# Altium schematic sheet Sheet1.SchDoc
size A; SheetNumber: 1; SheetTotal: 5
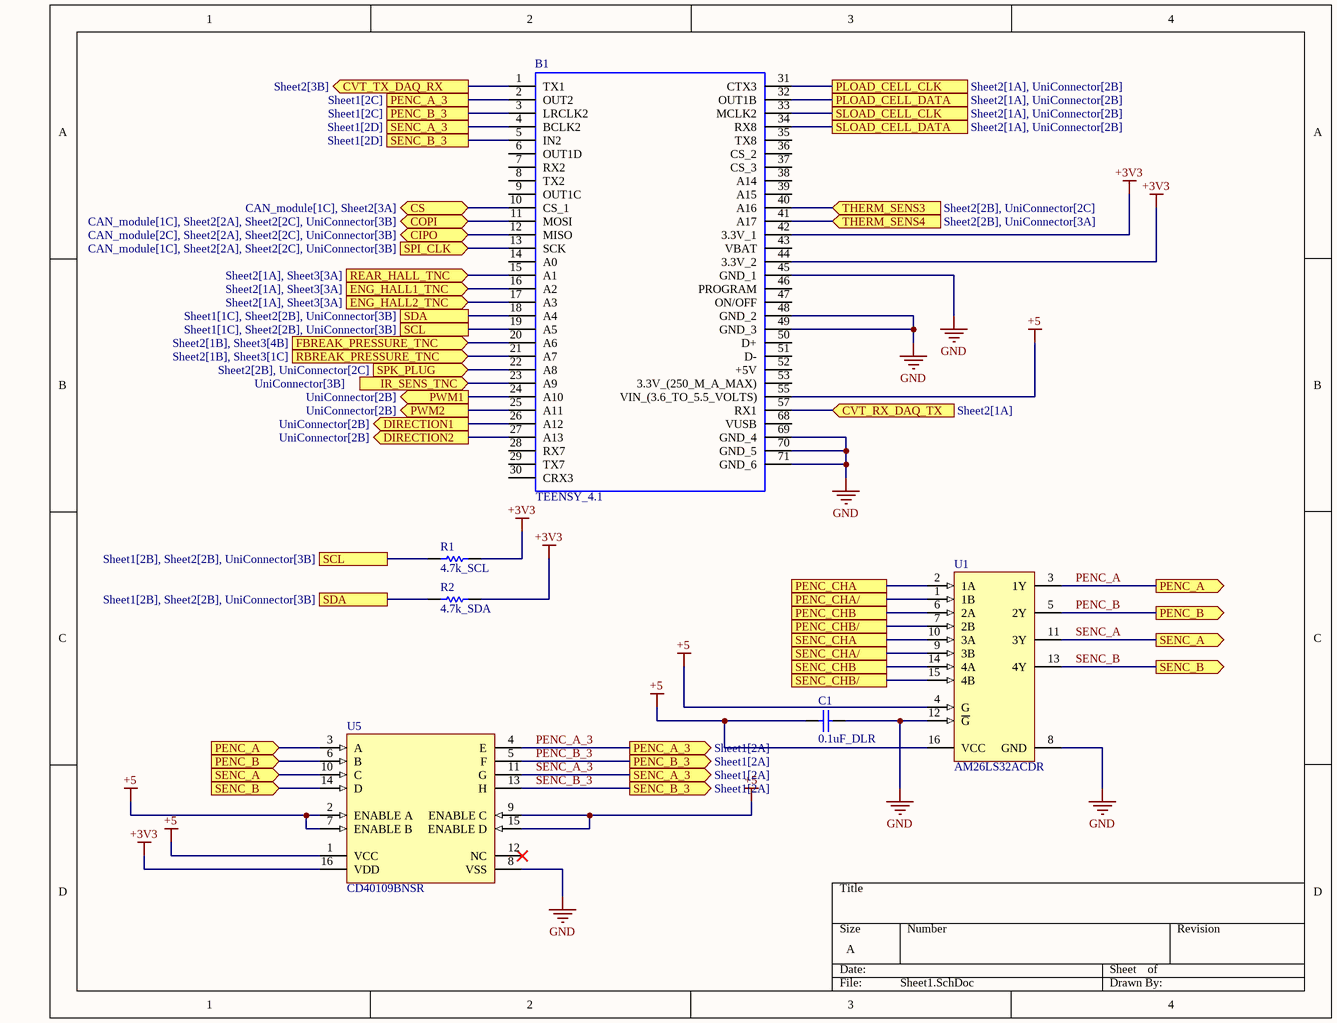
[diagram p0: Sheet1.SchDoc]

## Parts
B1  TEENSY_4.1  [TEENSY41]
C1  0.1uF_DLR  [CAPC2013X94X50LL20T25]
R1  4.7k_SCL  [RESC2013X60X40LL20T25]
R2  4.7k_SDA  [RESC2013X60X40LL20T25]
U1  AM26LS32ACDR  [D0016A_M]
U5  CD40109BNSR  [NS0016A_N]

## Ports
CIPO (bidir, see CAN_module[2C], Sheet2[2A], Sheet2[2C], UniConnector[3B]), COPI (bidir, see CAN_module[1C], Sheet2[2A], Sheet2[2C], UniConnector[3B]), CS (bidir, see CAN_module[1C], Sheet2[3A]), CVT_RX_DAQ_TX (in, see Sheet2[1A]), CVT_TX_DAQ_RX (out, see Sheet2[3B]), DIRECTION1 (out, see UniConnector[2B]), DIRECTION2 (out, see UniConnector[2B]), ENG_HALL1_TNC (in, see Sheet2[1A], Sheet3[3A]), ENG_HALL2_TNC (in, see Sheet2[1A], Sheet3[3A]), FBREAK_PRESSURE_TNC (in, see Sheet2[1B], Sheet3[4B]), IR_SENS_TNC (in, see UniConnector[3B]), PENC_A (in, see Sheet1[4C]), PENC_A (out, see Sheet1[1C]), PENC_A_3 (out, see Sheet1[2A]), PENC_A_3 (see Sheet1[2C]), PENC_B (in, see Sheet1[4C]), PENC_B (out, see Sheet1[1C]), PENC_B_3 (out, see Sheet1[2A]), PENC_B_3 (see Sheet1[2C]), PENC_CHA (see UniConnector[2A]), PENC_CHA/ (see UniConnector[2A]), PENC_CHB (see UniConnector[2A]), PENC_CHB/ (see UniConnector[2B]), PLOAD_CELL_CLK (see Sheet2[1A], UniConnector[2B]), PLOAD_CELL_DATA (see Sheet2[1A], UniConnector[2B]), PWM1 (out, see UniConnector[2B]), PWM2 (out, see UniConnector[2B]), RBREAK_PRESSURE_TNC (in, see Sheet2[1B], Sheet3[1C]), REAR_HALL_TNC (in, see Sheet2[1A], Sheet3[3A]), SCL (see Sheet1[1C], Sheet2[2B], UniConnector[3B]), SCL (see Sheet1[2B], Sheet2[2B], UniConnector[3B]), SDA (see Sheet1[1C], Sheet2[2B], UniConnector[3B]), SDA (see Sheet1[2B], Sheet2[2B], UniConnector[3B]), SENC_A (in, see Sheet1[4C]), SENC_A (out, see Sheet1[1D]), SENC_A_3 (out, see Sheet1[2A]), SENC_A_3 (see Sheet1[2D]), SENC_B (in, see Sheet1[4C]), SENC_B (out, see Sheet1[1D]), SENC_B_3 (out, see Sheet1[2A]), SENC_B_3 (see Sheet1[2D]), SENC_CHA (see UniConnector[2B]), SENC_CHA/ (see UniConnector[2B]), SENC_CHB (see UniConnector[2B]), SENC_CHB/ (see UniConnector[2B]), SLOAD_CELL_CLK (see Sheet2[1A], UniConnector[2B]), SLOAD_CELL_DATA (see Sheet2[1A], UniConnector[2B]), SPI_CLK (in, see CAN_module[1C], Sheet2[2A], Sheet2[2C], UniConnector[3B]), SPK_PLUG (in, see Sheet2[2B], UniConnector[2C]), THERM_SENS3 (in, see Sheet2[2B], UniConnector[2C]), THERM_SENS4 (in, see Sheet2[2B], UniConnector[3A])

## Nets
+3V3: B1.42(3.3V_1) B1.44(3.3V_2) R1.2 R2.2 U5.16(VDD)
+5: B1.55(VIN_(3.6_TO_5.5_VOLTS)) C1.1 U1.4(G) U1.16(VCC) U5.1(VCC) U5.2(ENABLE_A) U5.7(ENABLE_B) U5.9(ENABLE_C) U5.15(ENABLE_D)
GND: B1.45(GND_1) B1.48(GND_2) B1.49(GND_3) B1.69(GND_4) B1.70(GND_5) B1.71(GND_6) C1.2 U1.8(GND) U1.12(~{G}) U5.8(VSS)
CIPO: B1.12(MISO) ; port CIPO
COPI: B1.11(MOSI) ; port COPI
CS: B1.10(CS_1) ; port CS
CVT_RX_DAQ_TX: B1.57(RX1) ; port CVT_RX_DAQ_TX
CVT_TX_DAQ_RX: B1.1(TX1) ; port CVT_TX_DAQ_RX
DIRECTION1: B1.26(A12) ; port DIRECTION1
DIRECTION2: B1.27(A13) ; port DIRECTION2
ENG_HALL1_TNC: B1.16(A2) ; port ENG_HALL1_TNC
ENG_HALL2_TNC: B1.17(A3) ; port ENG_HALL2_TNC
FBREAK_PRESSURE_TNC: B1.20(A6) ; port FBREAK_PRESSURE_TNC
IR_SENS_TNC: B1.23(A9) ; port IR_SENS_TNC
PENC_A: U1.3(1Y) U5.3(A) ; port PENC_A
PENC_A_3: B1.2(OUT2) U5.4(E) ; port PENC_A_3
PENC_B: U1.5(2Y) U5.6(B) ; port PENC_B
PENC_B_3: B1.3(LRCLK2) U5.5(F) ; port PENC_B_3
PENC_CHA: U1.2(1A) ; port PENC_CHA
PENC_CHA/: U1.1(1B) ; port PENC_CHA/
PENC_CHB: U1.6(2A) ; port PENC_CHB
PENC_CHB/: U1.7(2B) ; port PENC_CHB/
PLOAD_CELL_CLK: B1.31(CTX3) ; port PLOAD_CELL_CLK
PLOAD_CELL_DATA: B1.32(OUT1B) ; port PLOAD_CELL_DATA
PWM1: B1.24(A10) ; port PWM1
PWM2: B1.25(A11) ; port PWM2
RBREAK_PRESSURE_TNC: B1.21(A7) ; port RBREAK_PRESSURE_TNC
REAR_HALL_TNC: B1.15(A1) ; port REAR_HALL_TNC
SCL: B1.19(A5) R1.1 ; port SCL
SDA: B1.18(A4) R2.1 ; port SDA
SENC_A: U1.11(3Y) U5.10(C) ; port SENC_A
SENC_A_3: B1.4(BCLK2) U5.11(G) ; port SENC_A_3
SENC_B: U1.13(4Y) U5.14(D) ; port SENC_B
SENC_B_3: B1.5(IN2) U5.13(H) ; port SENC_B_3
SENC_CHA: U1.10(3A) ; port SENC_CHA
SENC_CHA/: U1.9(3B) ; port SENC_CHA/
SENC_CHB: U1.14(4A) ; port SENC_CHB
SENC_CHB/: U1.15(4B) ; port SENC_CHB/
SLOAD_CELL_CLK: B1.33(MCLK2) ; port SLOAD_CELL_CLK
SLOAD_CELL_DATA: B1.34(RX8) ; port SLOAD_CELL_DATA
SPI_CLK: B1.13(SCK) ; port SPI_CLK
SPK_PLUG: B1.22(A8) ; port SPK_PLUG
THERM_SENS3: B1.40(A16) ; port THERM_SENS3
THERM_SENS4: B1.41(A17) ; port THERM_SENS4

Not connected (* = marked no-connect by the designer): B1 6(OUT1D) 7(RX2) 8(TX2) 9(OUT1C) 14(A0) 28(RX7) 29(TX7) 30(CRX3) 35(TX8) 36(CS_2) 37(CS_3) 38(A14) 39(A15) 43(VBAT) 46(PROGRAM) 47(ON/OFF) 50(D+) 51(D-) 52(+5V) 53(3.3V_(250_M_A_MAX)) 68(VUSB); U5 12(NC)*

## Library data of the parts
B1 = TEENSY_4.1: Teensy 4.1 Development Board; Manufacturer_Name: PJRC; Manufacturer_Part_Number: TEENSY 4.1; Mouser Part Number: *; Mouser Price/Stock: *; Arrow Part Number: *; Arrow Price/Stock: *; Mouser Testing Part Number: *; Mouser Testing Price/Stock: *; Datasheet Link: https://www.pjrc.com/store/teensy41.html
C1 = CMP-2007-04345-1: Manufacturer: AVX Interconnect / Elco; Part Number: 08055A6R2CAT2A
R1 R2 = CMP-2001-00877-1: Manufacturer: Panasonic; Part Number: ERA6AEB7870V
U1 = CMP-0310-00258-2: Quadruple Differential Line Receiver, 0 TX / 4 RX, 0 to 70 degC, 16-Pin SOIC (D), Green (RoHS & no Sb/Br); Manufacturer: Texas Instruments; Rating: Catalog; ICC(Max)(mA): 70; SubFamily: RS-422; Receivers Per Package: 4; ComponentLink1Description: Datasheet; # of TX/RX: 0 TX / 4 RX; Mounting Technology: Surface Mount; Code_JEDEC: MS-012AC; DatasheetVersion: SLLS115E; ComponentLink2Description: Package Specification; Eco-Plan: Green (RoHS & no Sb/Br); PackageDescription: 16-Pin Plastic Small Outline Integrated Circuit, 9.9 x 3.9 mm, Pitch 1.27 mm Pitch; ComponentLink2URL: http://www.ti.com/litv/pdf/mpds178g; PartNumber: AM26LS32ACDR; PackageReference: D0016A; PackageVersion: revM, Jun-2011; ComponentLink1URL: http://www.ti.com/general/docs/lit/getliterature.tsp?genericPartNumber=AM26LS32AC&fileType=pdf
U5 = CMP-1527-00005-2: CMOS Quad Low-to-High Voltage Level Shifter, 3 to 18 V, -55 to 125 degC, 16-Pin SO (NS16), RoHS, Tape and Reel; Manufacturer: Texas Instruments; Number of Channels: 4; VSS: 3 to 18 V; Propagation Delay: 240 ns Max.; ComponentLink2Description: Datasheet; PackageDescription: 16-Pin Plastic Small Outline Package, Body 10.2 x 5.3 mm, Pitch 1.27 mm; Mounting Technology: Surface Mount; Number of Outputs: 4; ComponentLink3URL: http://www.ti.com/lit/ml/msop002a/msop002a.pdf; Packing: Tape and Reel; RoHS: TRUE; Temperature Range: -55 to 125 degC; PartNumber: CD40109BNSR; PackageVersion: 4040062/C; ComponentLink3Description: Package Specification; DatasheetVersion: SCHS099B; ComponentLink2URL: http://www.ti.com/lit/ds/symlink/cd40109b.pdf; Package Reference: NS0016A; Number of Bits: 4; ComponentLink1Description: Manufacturer URL; ComponentLink1URL: www.ti.com